# Altium schematic sheet 01 Revision History and Contents.SchDoc: ECE453TutorialBoard
size B; DrawnBy: JMP; Engineer: JMP; ProjectName: ECE453TutorialBoard
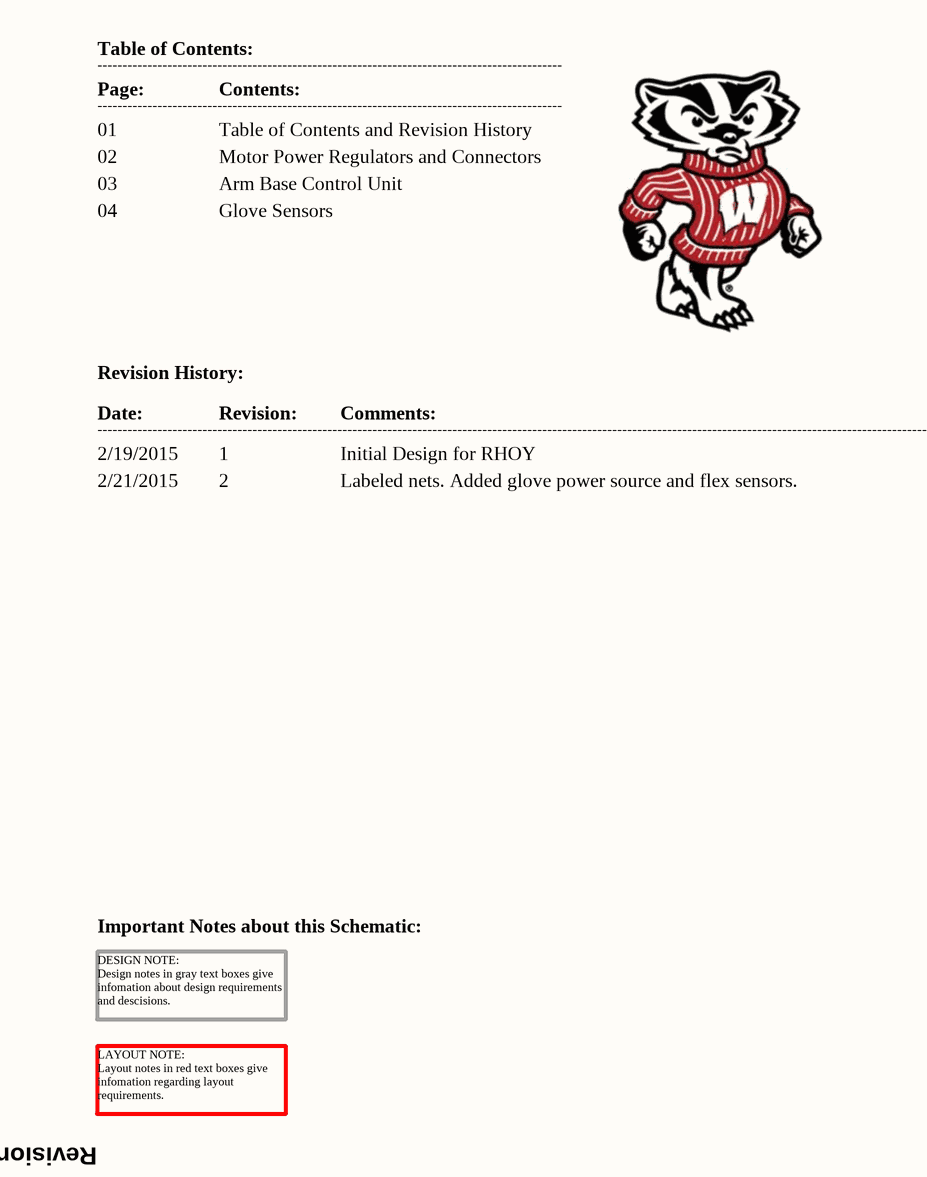
[diagram p0: 01 Revision History and Contents.SchDoc, left]
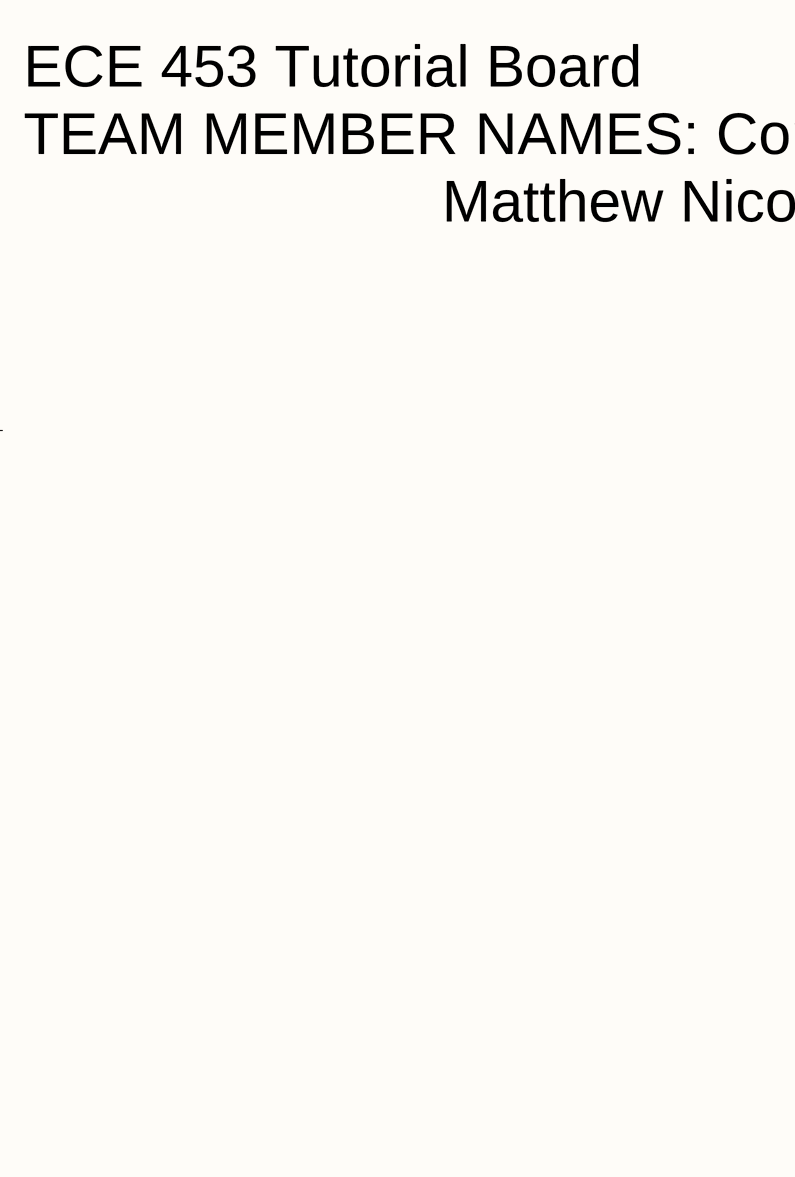
[diagram p1: 01 Revision History and Contents.SchDoc, right]

## Notes on the sheet
- Table of Contents:
- Page:
- ---------------------------------------------------------------------------------------------
- Contents:
- ECE 453 Tutorial Board
- 01
- 02
- 03
- Table of Contents and Revision History
- Motor Power Regulators and Connectors
- Arm Base Control Unit
- TEAM MEMBER NAMES: Conner Huff, Tiffany Voss,
- 04
- Glove Sensors
- Matthew Nicol, Nick Koxlien
- Revision History:
- Date:
- 2/19/2015
- ----------------------------------------------------------------------------------------------------------------------------------------------------------------------
- Revision:
- 1
- Comments:
- Initial Design for RHOY
- 2/21/2015
- 2
- Labeled nets. Added glove power source and flex sensors.
- Important Notes about this Schematic:
- DESIGN NOTE:
  Design notes in gray text boxes give infomation about design requirements and descisions.
- Revision History and Table of Contents
- LAYOUT NOTE:
  Layout notes in red text boxes give infomation regarding layout requirements.